# EasyEDA Pro project sensor_16_analog.eprj

# Schematic sensor_16
Board Name: sensor_16; Create Date: 2025-12-02; Page Name: sensor_16; Project Name: sensor_16_analog; Schematic Name: sensor_16; Update Date: 2025-12-02; File: sensor_16; Id: /; Sheet: /
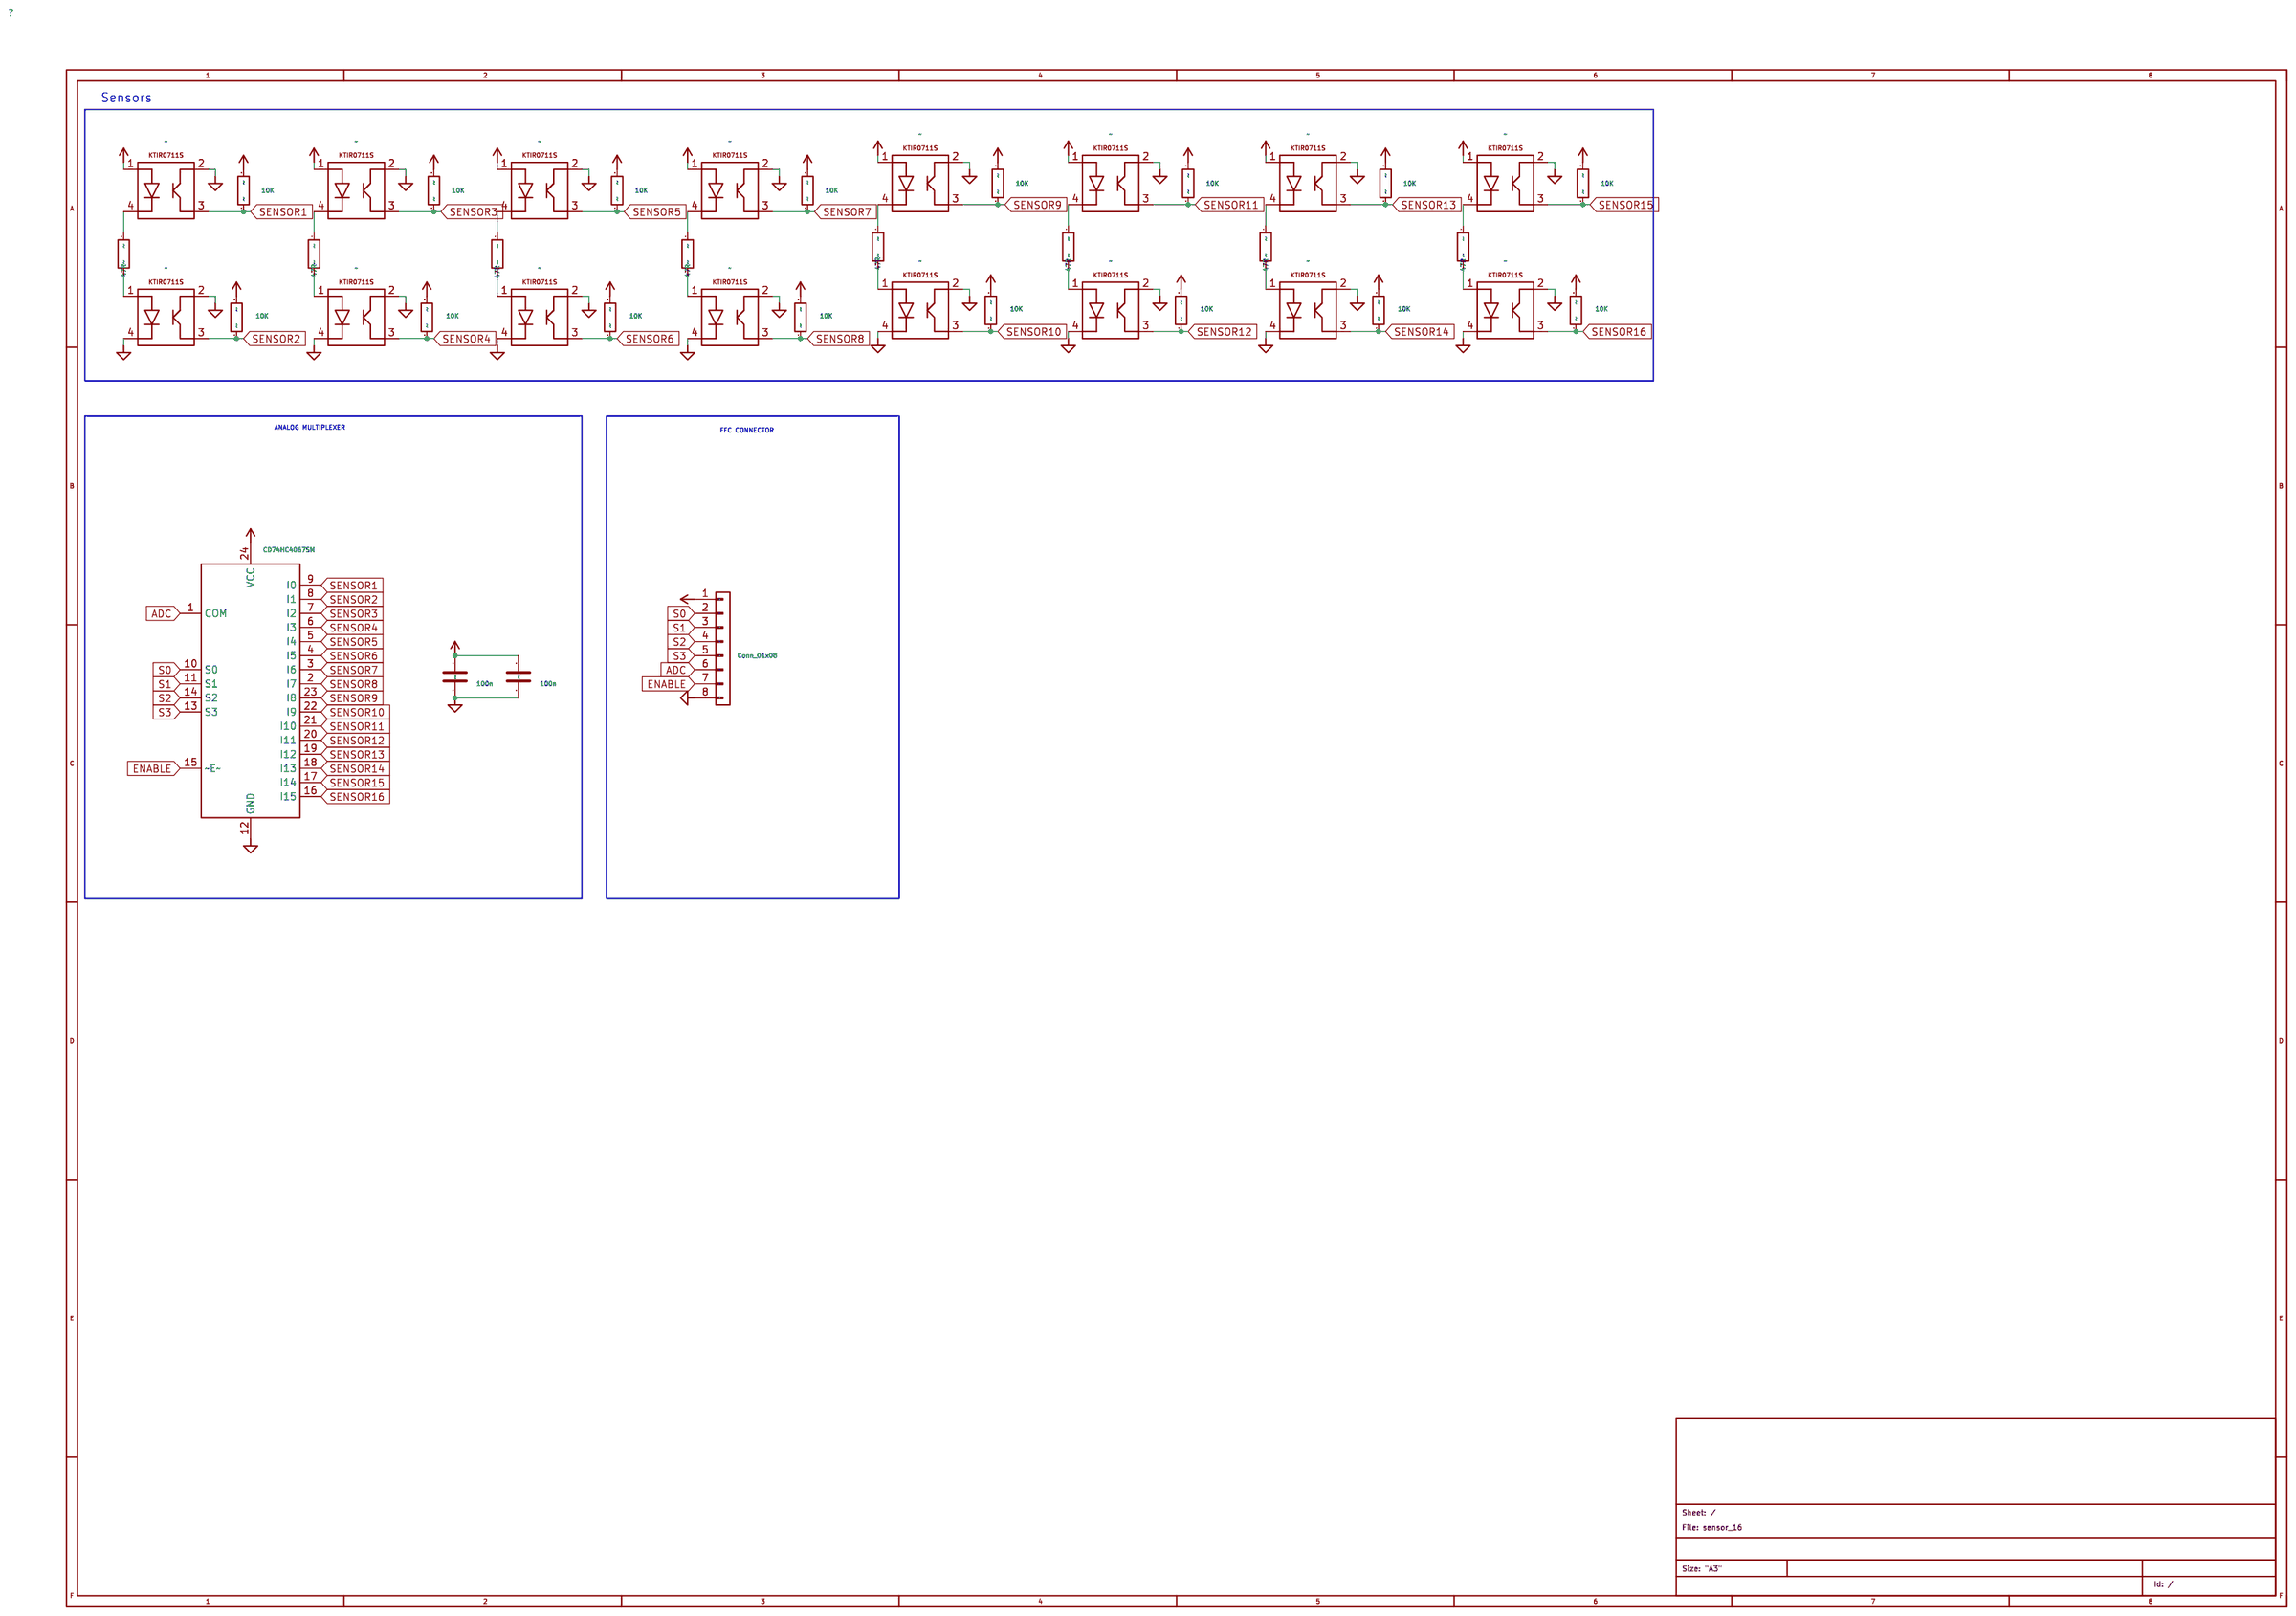
[diagram p0: schematic sheet]

## Parts
C1  100n  [Capacitor_SMD:C_0402_1005Metric_Pad0.74x0.62mm_HandSolder]
C2  100n  [Capacitor_SMD:C_0402_1005Metric_Pad0.74x0.62mm_HandSolder]
J1  Conn_01x08  [Connector_FFC-FPC:Hirose_FH12-8S-0.5SH_1x08-1MP_P0.50mm_Horizontal]
R1  47R  [Resistor_SMD:R_0603_1608Metric_Pad0.98x0.95mm_HandSolder]
R2  10K  [Resistor_SMD:R_0402_1005Metric_Pad0.72x0.64mm_HandSolder]
R3  10K  [Resistor_SMD:R_0402_1005Metric_Pad0.72x0.64mm_HandSolder]
R4  47R  [Resistor_SMD:R_0603_1608Metric_Pad0.98x0.95mm_HandSolder]
R5  10K  [Resistor_SMD:R_0402_1005Metric_Pad0.72x0.64mm_HandSolder]
R6  10K  [Resistor_SMD:R_0402_1005Metric_Pad0.72x0.64mm_HandSolder]
R7  47R  [Resistor_SMD:R_0603_1608Metric_Pad0.98x0.95mm_HandSolder]
R8  10K  [Resistor_SMD:R_0402_1005Metric_Pad0.72x0.64mm_HandSolder]
R9  10K  [Resistor_SMD:R_0402_1005Metric_Pad0.72x0.64mm_HandSolder]
R10  47R  [Resistor_SMD:R_0603_1608Metric_Pad0.98x0.95mm_HandSolder]
R11  10K  [Resistor_SMD:R_0402_1005Metric_Pad0.72x0.64mm_HandSolder]
R12  10K  [Resistor_SMD:R_0402_1005Metric_Pad0.72x0.64mm_HandSolder]
R13  47R  [Resistor_SMD:R_0603_1608Metric_Pad0.98x0.95mm_HandSolder]
R14  10K  [Resistor_SMD:R_0402_1005Metric_Pad0.72x0.64mm_HandSolder]
R15  10K  [Resistor_SMD:R_0402_1005Metric_Pad0.72x0.64mm_HandSolder]
R16  47R  [Resistor_SMD:R_0603_1608Metric_Pad0.98x0.95mm_HandSolder]
R17  10K  [Resistor_SMD:R_0402_1005Metric_Pad0.72x0.64mm_HandSolder]
R18  10K  [Resistor_SMD:R_0402_1005Metric_Pad0.72x0.64mm_HandSolder]
R19  47R  [Resistor_SMD:R_0603_1608Metric_Pad0.98x0.95mm_HandSolder]
R20  10K  [Resistor_SMD:R_0402_1005Metric_Pad0.72x0.64mm_HandSolder]
R21  10K  [Resistor_SMD:R_0402_1005Metric_Pad0.72x0.64mm_HandSolder]
R22  47R  [Resistor_SMD:R_0603_1608Metric_Pad0.98x0.95mm_HandSolder]
R23  10K  [Resistor_SMD:R_0402_1005Metric_Pad0.72x0.64mm_HandSolder]
R24  10K  [Resistor_SMD:R_0402_1005Metric_Pad0.72x0.64mm_HandSolder]
U1  -  [SensorLib:KTIR0711S]
U2  -  [SensorLib:KTIR0711S]
U3  -  [SensorLib:KTIR0711S]
U4  -  [SensorLib:KTIR0711S]
U5  -  [SensorLib:KTIR0711S]
U6  -  [SensorLib:KTIR0711S]
U7  -  [SensorLib:KTIR0711S]
U8  -  [SensorLib:KTIR0711S]
U9  -  [SensorLib:KTIR0711S]
U10  -  [SensorLib:KTIR0711S]
U11  -  [SensorLib:KTIR0711S]
U12  -  [SensorLib:KTIR0711S]
U13  -  [SensorLib:KTIR0711S]
U14  -  [SensorLib:KTIR0711S]
U15  -  [SensorLib:KTIR0711S]
U16  -  [SensorLib:KTIR0711S]
U17  CD74HC4067SM  [footprints:TSSOP24_4P5X7P9_TEX-M]

## Library data of the parts
C1 = Device_C: Unpolarized capacitor; Attribute1: C2
C2 = Device_C: Unpolarized capacitor
J1 = Connector_Generic_Conn_01x08: Generic connector, single row, 01x08, script generated (kicad-library-utils/schlib/autogen/connector/)
R1 R4 R7 R13 R16 R19 R22 = Device_R: Resistor; Attribute1: R10
R2 R3 R5 R6 R8 R9 R11 R12 R14 R15 R17 R18 R21 R23 R24 = Device_R: Resistor; Attribute1: R20
R10 R20 = Device_R: Resistor
U1-U5 U7-U16 = Sensor_Library_KTIR0711S: Attribute1: U6
U6 = Sensor_Library_KTIR0711S
U17 = 74xx_CD74HC4067SM: High-Speed CMOS Logic 16-Channel Analog Multiplexer/Demultiplexer, SSOP-24; Attribute1: *; Attribute2: *; Attribute3: *; Attribute5: *; Datasheet: http://www.ti.com/lit/ds/symlink/cd74hc4067.pdf; User doc link: http://www.ti.com/lit/ds/symlink/cd74hc4067.pdf

## Nets
ADC: J1.6(Pin) U17.1(COM)
ENABLE: J1.7(Pin) U17.15(~E~)
POWER_+3.3V: C1.1 C2.1 J1.1(Pin) R2.2 R3.2 R5.2 R6.2 R8.2 R9.2 R11.2 R12.2 R14.2 R15.2 R17.2 R18.2 R20.2 R21.2 R23.2 R24.2 U1.1 U3.1 U5.1 U7.1 U9.1 U11.1 U13.1 U15.1 U17.24(VCC)
POWER_GND: C1.2 C2.2 J1.8(Pin) U1.2 U2.2 U2.4 U3.2 U4.2 U4.4 U5.2 U6.2 U6.4 U7.2 U8.2 U8.4 U9.2 U10.2 U10.4 U11.2 U12.2 U12.4 U13.2 U14.2 U14.4 U15.2 U16.2 U16.4 U17.12(GND)
S0: J1.2(Pin) U17.10(S0)
S1: J1.3(Pin) U17.11(S1)
S2: J1.4(Pin) U17.14(S2)
S3: J1.5(Pin) U17.13(S3)
SENSOR1: R3.1 U1.3 U17.9(I0)
SENSOR2: R2.1 U2.3 U17.8(I1)
SENSOR3: R6.1 U3.3 U17.7(I2)
SENSOR4: R5.1 U4.3 U17.6(I3)
SENSOR5: R9.1 U5.3 U17.5(I4)
SENSOR6: R8.1 U6.3 U17.4(I5)
SENSOR7: R12.1 U7.3 U17.3(I6)
SENSOR8: R11.1 U8.3 U17.2(I7)
SENSOR9: R15.1 U9.3 U17.23(I8)
SENSOR10: R14.1 U10.3 U17.22(I9)
SENSOR11: R18.1 U11.3 U17.21(I10)
SENSOR12: R17.1 U12.3 U17.20(I11)
SENSOR13: R21.1 U13.3 U17.19(I12)
SENSOR14: R20.1 U14.3 U17.18(I13)
SENSOR15: R24.1 U15.3 U17.17(I14)
SENSOR16: R23.1 U16.3 U17.16(I15)
Net-(R1-1): R1.1 U1.4
Net-(R1-2): R1.2 U2.1
Net-(R4-1): R4.1 U3.4
Net-(R4-2): R4.2 U4.1
Net-(R7-1): R7.1 U5.4
Net-(R7-2): R7.2 U6.1
Net-(R10-1): R10.1 U7.4
Net-(R10-2): R10.2 U8.1
Net-(R13-1): R13.1 U9.4
Net-(R13-2): R13.2 U10.1
Net-(R16-1): R16.1 U11.4
Net-(R16-2): R16.2 U12.1
Net-(R19-1): R19.1 U13.4
Net-(R19-2): R19.2 U14.1
Net-(R22-1): R22.1 U15.4
Net-(R22-2): R22.2 U16.1

## Notes on the sheet
- Sensors
- ANALOG MULTIPLEXER
- FFC CONNECTOR
